# Altium schematic sheet Artix7_IO_General.SchDoc
size A3; SheetNumber: 12; SheetTotal: 14
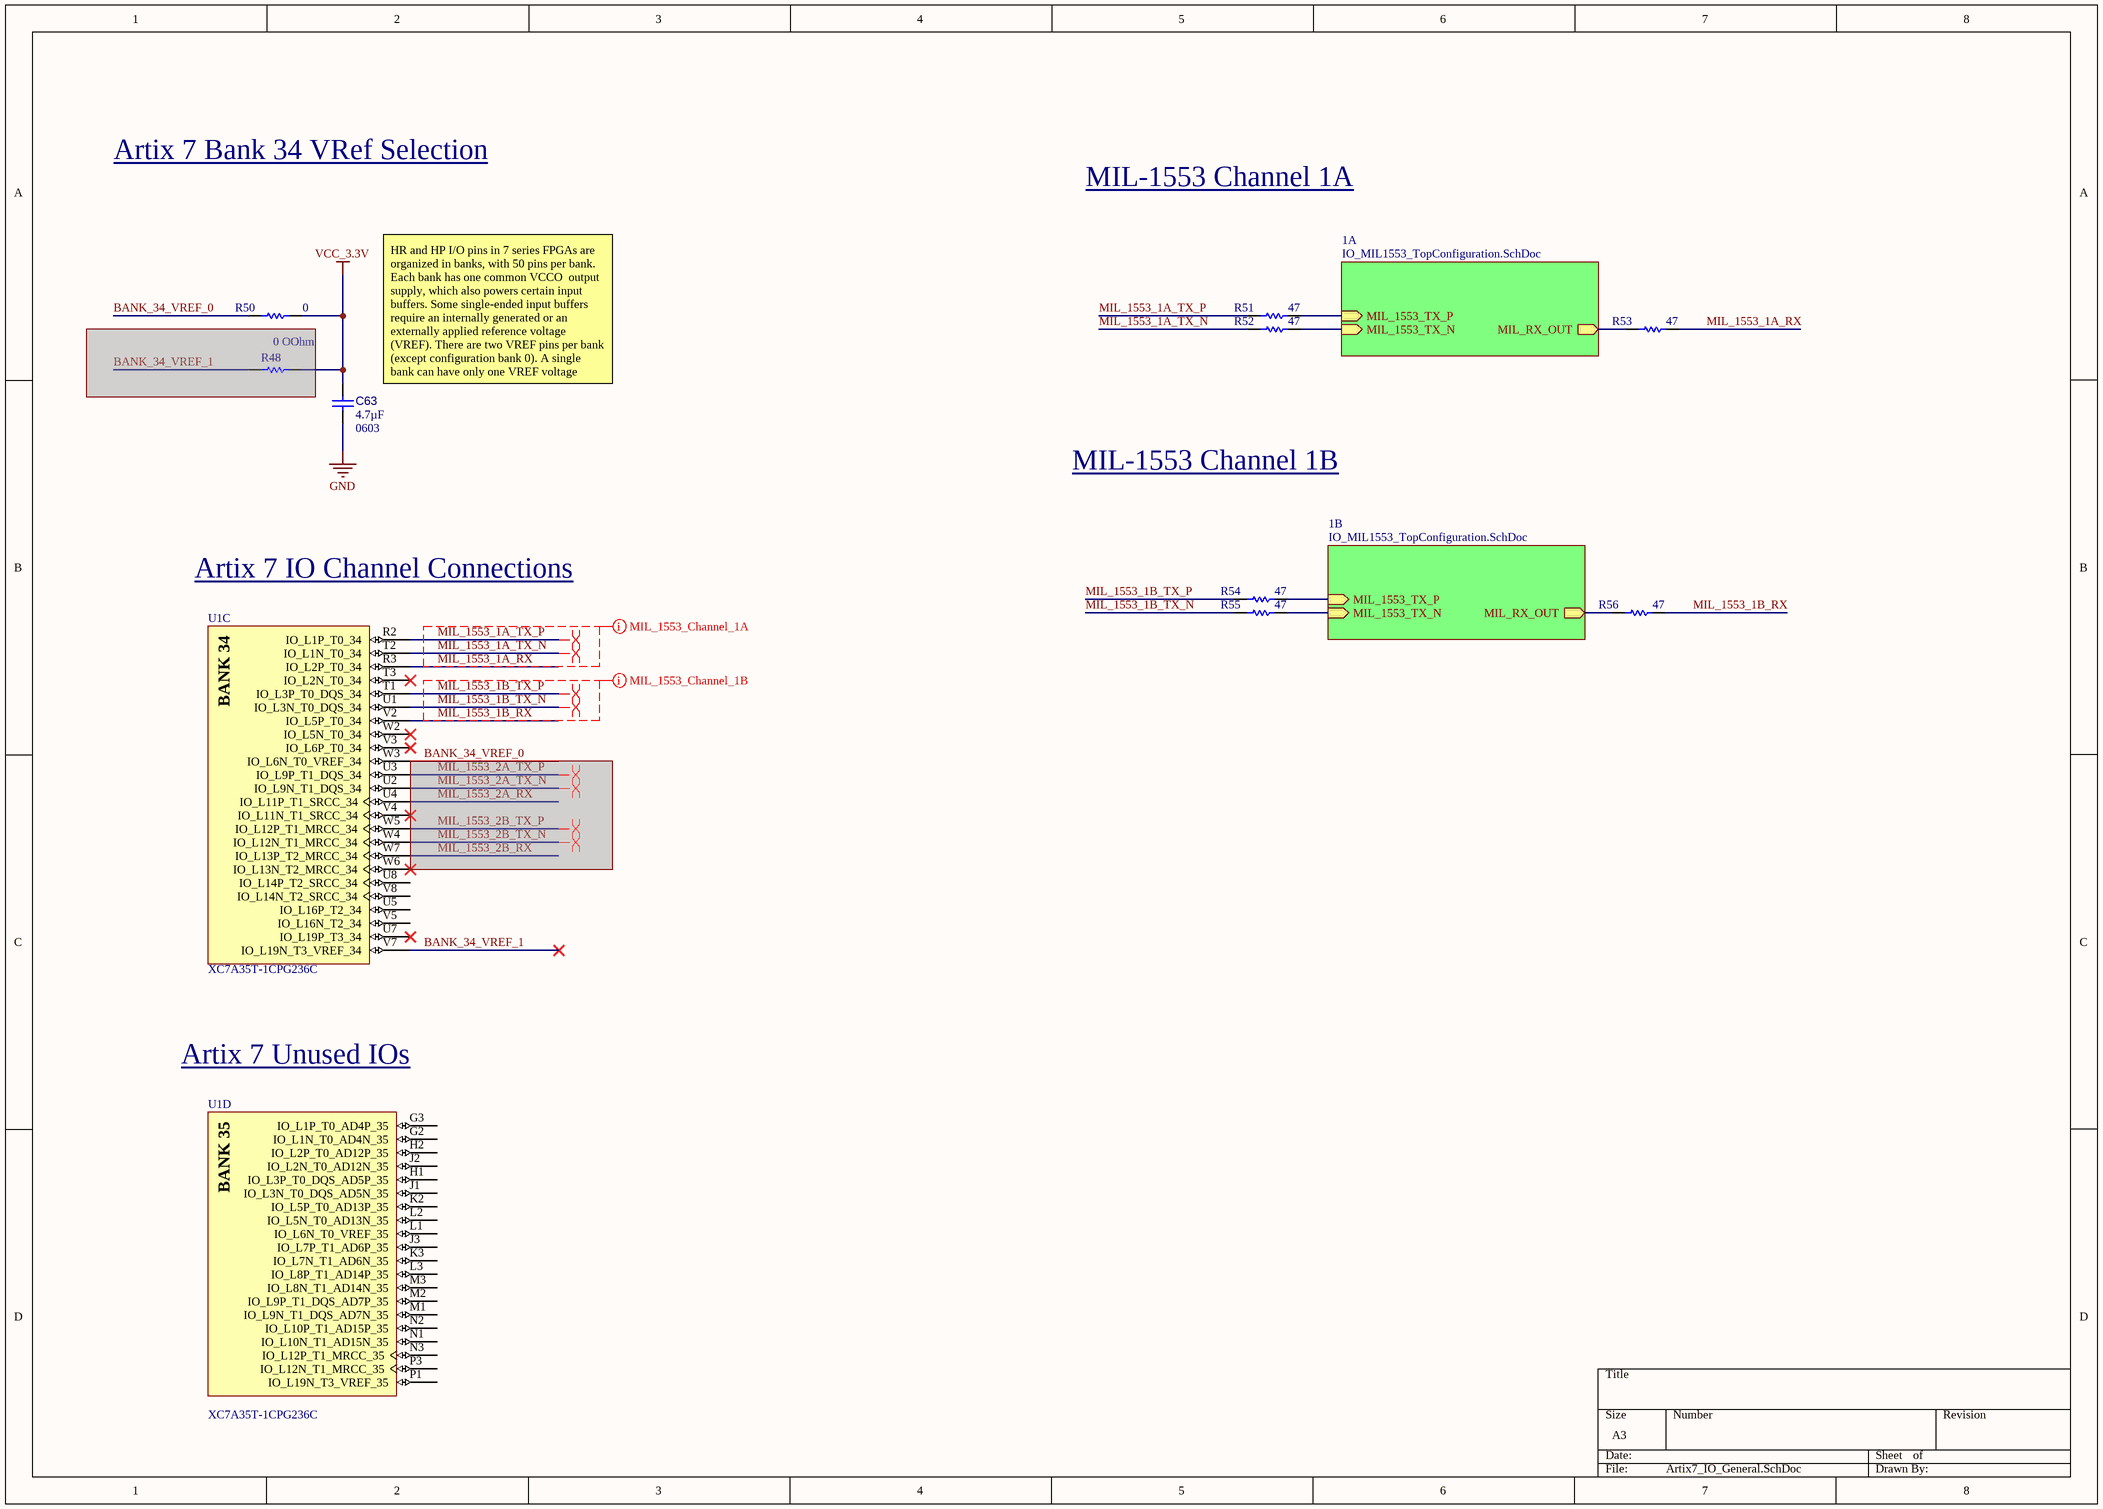
[diagram p0: Artix7_IO_General.SchDoc]

## Parts
C63  value 4.7µF  Case/Package: 0603  [CAPC0603(1608)100_L]  (hidden comment: Capacitor 4.7µF +/-20% 10V 0603)
R48  value 0 OOhm  [RESC1005X40X25ML05T05]  (hidden comment: Resistor 1k +/-1% 0402 100 mW)  (net tie)  (masked out: inside a compile mask, not in the netlist)
R50  value 0  [RESC1005X40X25ML05T05]  (hidden comment: Resistor 1k +/-1% 0402 100 mW)  (net tie)
R51  value 47  [RESC1005X40X25LL10T10]  (hidden comment: ERA-2AEB470X)
R52  value 47  [RESC1005X40X25LL10T10]  (hidden comment: ERA-2AEB470X)
R53  value 47  [RESC1005X40X25LL10T10]  (hidden comment: ERA-2AEB470X)
R54  value 47  [RESC1005X40X25LL10T10]  (hidden comment: ERA-2AEB470X)
R55  value 47  [RESC1005X40X25LL10T10]  (hidden comment: ERA-2AEB470X)
R56  value 47  [RESC1005X40X25LL10T10]  (hidden comment: ERA-2AEB470X)
U1  XC7A35T-1CPG236C  [CPG236]  (parts C,D of 10)

## Sub-sheets
1A = IO_MIL1553_TopConfiguration.SchDoc: MIL_1553_TX_N (in), MIL_1553_TX_P (in), MIL_RX_OUT (out)
1B = IO_MIL1553_TopConfiguration.SchDoc: MIL_1553_TX_N (in), MIL_1553_TX_P (in), MIL_RX_OUT (out)

## Nets
GND: C63.2
VCC_3.3V: C63.1 R50.1
BANK_34_VREF_0: R50.2
BANK_34_VREF_1: U1.V7(IO_L19N_T3_VREF_34)
MIL_1553_1A_RX: R53.2 U1.R3(IO_L2P_T0_34)
MIL_1553_1A_TX_N: R52.1 U1.T2(IO_L1N_T0_34)
MIL_1553_1A_TX_P: R51.1 U1.R2(IO_L1P_T0_34)
MIL_1553_1B_RX: R56.2 U1.V2(IO_L5P_T0_34)
MIL_1553_1B_TX_N: R55.1 U1.U1(IO_L3N_T0_DQS_34)
MIL_1553_1B_TX_P: R54.1 U1.T1(IO_L3P_T0_DQS_34)
NetR51_2: R51.2 ; sheet 1A/MIL_1553_TX_P
NetR52_2: R52.2 ; sheet 1A/MIL_1553_TX_N
NetR53_1: R53.1 ; sheet 1A/MIL_RX_OUT
NetR54_2: R54.2 ; sheet 1B/MIL_1553_TX_P
NetR55_2: R55.2 ; sheet 1B/MIL_1553_TX_N
NetR56_1: R56.1 ; sheet 1B/MIL_RX_OUT

Not connected (* = marked no-connect by the designer): U1 G2(IO_L1N_T0_AD4N_35) G3(IO_L1P_T0_AD4P_35) H1(IO_L3P_T0_DQS_AD5P_35) H2(IO_L2P_T0_AD12P_35) J1(IO_L3N_T0_DQS_AD5N_35) J2(IO_L2N_T0_AD12N_35) J3(IO_L7P_T1_AD6P_35) K2(IO_L5P_T0_AD13P_35) K3(IO_L7N_T1_AD6N_35) L1(IO_L6N_T0_VREF_35) L2(IO_L5N_T0_AD13N_35) L3(IO_L8P_T1_AD14P_35) M1(IO_L9N_T1_DQS_AD7N_35) M2(IO_L9P_T1_DQS_AD7P_35) M3(IO_L8N_T1_AD14N_35) N1(IO_L10N_T1_AD15N_35) N2(IO_L10P_T1_AD15P_35) N3(IO_L12P_T1_MRCC_35) P1(IO_L19N_T3_VREF_35) P3(IO_L12N_T1_MRCC_35) T3(IO_L2N_T0_34)* U2(IO_L9N_T1_DQS_34) U3(IO_L9P_T1_DQS_34) U4(IO_L11P_T1_SRCC_34) U5(IO_L16P_T2_34) U7(IO_L19P_T3_34)* U8(IO_L14P_T2_SRCC_34) V3(IO_L6P_T0_34)* V4(IO_L11N_T1_SRCC_34)* V5(IO_L16N_T2_34) V8(IO_L14N_T2_SRCC_34) W2(IO_L5N_T0_34)* W3(IO_L6N_T0_VREF_34) W4(IO_L12N_T1_MRCC_34) W5(IO_L12P_T1_MRCC_34) W6(IO_L13N_T2_MRCC_34)* W7(IO_L13P_T2_MRCC_34)

## Layout directives
differential pair: (no net found under the mark), MIL_1553_1A_TX_N, MIL_1553_1A_TX_P, MIL_1553_1B_TX_N, MIL_1553_1B_TX_P
net class MIL1553 Channel 1A: MIL_1553_1A_RX, MIL_1553_1A_TX_N, MIL_1553_1A_TX_P
net class MIL1553 Channel 1B: MIL_1553_1B_RX, MIL_1553_1B_TX_N, MIL_1553_1B_TX_P

## Notes on the sheet
- Artix 7 Bank 34 VRef Selection
- MIL-1553 Channel 1A
- (near C63) HR and HP I/O pins in 7 series FPGAs are organized in banks, with 50 pins per bank. Each bank has one common VCCO  output supply, which also powers certain input buffers. Some single-ended input buffers require an internally generated or an  externally applied reference voltage (VREF). There are two VREF pins per bank (except configuration bank 0). A single bank can have only one VREF voltage value.
- MIL-1553 Channel 1B
- Artix 7 IO Channel Connections
- Artix 7 Unused IOs
- (in symbol CMP-0383-00006-1, part C) BANK 34
- (in symbol CMP-0383-00006-1, part D) BANK 35

## Library data of the parts
C63 = CMP-001-00076-5: Chip Capacitor, 4.7µF +/-20%, 10V, 0603, Thickness 1 mm; Tolerance: 10%; Max Operating Temperature: 85°C; Voltage Rating: 10V; Min Operating Temperature: -55°C; Pins: 2; Mounting Technology: SMT
R48 R50 = CMP-009-00009-5: Chip Resistor, 1 KOhm, +/- 1%, 0.1 W, -55 to 155 degC, 0402 (1005 Metric); Voltage Rating: 50V; Power: 100mW; Max Operating Temperature: 155°C; Tolerance: 1%; Case/Package: 0402; Min Operating Temperature: -55°C; RoHS Compliant: True; Mounting Technology: SM; Pins: 2
R51-R56 = CMP-009-00190-1: Fixed Resistor, Thin Film, 0.063W, 47ohm, 50V, 0.1% +/-Tol, 25ppm/Cel, Surface Mount, 0402; Power: 63mW; Min Operating Temperature: -55°C; Tolerance: 0.1%; Mounting Technology: Surface Mount; Max Operating Temperature: 155°C; RoHS Compliant: Yes; Case/Package: 0402; Pins: 2
U1 = CMP-0383-00006-1: Artix-7 FPGA, 106 User I/Os, 2 GTP, 238-Ball BGA, Speed Grade 1, Commercial Grade, Pb-Free; Manufacturer: Xilinx; CMTs: 5; Total Block RAM: 1800 Kb; Logic Cells: 33280; Speed Grades: 1; GTP: 2; Available User I/O: 106; ComponentLink1URL: http://www.xilinx.com/; Maximum Distributed RAM: 400 Kb; PackageVersion: Rev. 1.11; PartNumber: XC7A35T-1CPG236C; ComponentLink2URL: http://www.xilinx.com/support/documentation/data_sheets/ds180_7Series_Overview.pdf; DatasheetVersion: Rev. 1.15; ComponentLink1Description: Manufacturer URL; ComponentLink3Description: Pinout; ComponentLink4Description: Package Specification; Mounting Technology: Surface Mount; PackageReference: CPG-236; Operating Temperature Range: Commercial; PackageDescription: 238-Ball Wire-Bond Chip-Scale BGA, Body 10 x10 mm, Pitch 0.5 mm; ComponentLink3URL: http://www.xilinx.com/support/documentation/user_guides/ug475_7Series_Pkg_Pinout.pdf; ComponentLink4URL: http://www.xilinx.com/support/documentation/user_guides/ug475_7Series_Pkg_Pinout.pdf; ComponentLink2Description: Datasheet